# Altium schematic sheet ddr2_memory.SchDoc
size A
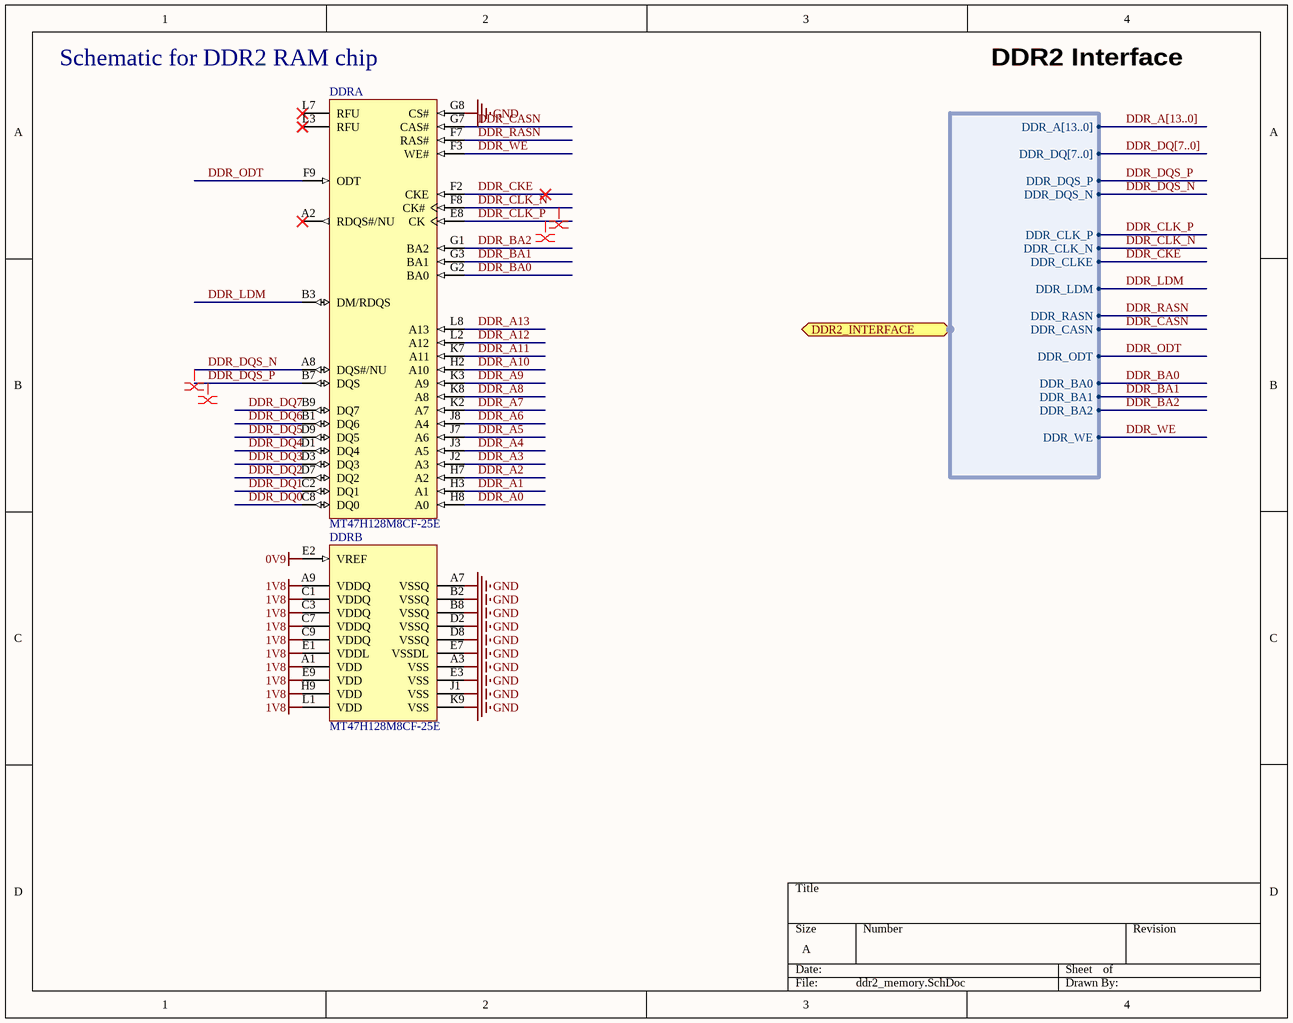
[diagram p0: ddr2_memory.SchDoc]

## Parts
DDR  MT47H128M8CF-25E  [MICT-CF-60]  (parts A,B of 2)

## Ports
DDR2_INTERFACE (harness DDR2_INTERFACE)

## Harnesses
DDR2_INTERFACE: DDR_A[13..0], DDR_DQ[7..0], DDR_DQS_P, DDR_DQS_N, DDR_CLK_P, DDR_CLK_N, DDR_LDM, DDR_RASN, DDR_CASN, DDR_ODT, DDR_BA0, DDR_BA1, DDR_BA2, DDR_WE, DDR_CLKE

## Nets
0V9: DDR.E2(VREF)
1V8: DDR.A1(VDD) DDR.A9(VDDQ) DDR.C1(VDDQ) DDR.C3(VDDQ) DDR.C7(VDDQ) DDR.C9(VDDQ) DDR.E1(VDDL) DDR.E9(VDD) DDR.H9(VDD) DDR.L1(VDD)
GND: DDR.A3(VSS) DDR.A7(VSSQ) DDR.B2(VSSQ) DDR.B8(VSSQ) DDR.D2(VSSQ) DDR.D8(VSSQ) DDR.E3(VSS) DDR.E7(VSSDL) DDR.G8(CS#) DDR.J1(VSS) DDR.K9(VSS)
DDR_A0: DDR.H8(A0)
DDR_A1: DDR.H3(A1)
DDR_A2: DDR.H7(A2)
DDR_A3: DDR.J2(A3)
DDR_A4: DDR.J3(A5)
DDR_A5: DDR.J7(A6)
DDR_A6: DDR.J8(A4)
DDR_A7: DDR.K2(A7)
DDR_A8: DDR.K8(A8)
DDR_A9: DDR.K3(A9)
DDR_A10: DDR.H2(A10)
DDR_A11: DDR.K7(A11)
DDR_A12: DDR.L2(A12)
DDR_A13: DDR.L8(A13)
DDR_BA0: DDR.G2(BA0) ; port DDR2_INTERFACE.DDR_BA0
DDR_BA1: DDR.G3(BA1) ; port DDR2_INTERFACE.DDR_BA1
DDR_BA2: DDR.G1(BA2) ; port DDR2_INTERFACE.DDR_BA2
DDR_CASN: DDR.G7(CAS#) ; port DDR2_INTERFACE.DDR_CASN
DDR_CKE: DDR.F2(CKE) ; port DDR2_INTERFACE.DDR_CLKE
DDR_CLK_N: DDR.F8(CK#) ; port DDR2_INTERFACE.DDR_CLK_N
DDR_CLK_P: DDR.E8(CK) ; port DDR2_INTERFACE.DDR_CLK_P
DDR_DQ0: DDR.C8(DQ0)
DDR_DQ1: DDR.C2(DQ1)
DDR_DQ2: DDR.D7(DQ2)
DDR_DQ3: DDR.D3(DQ3)
DDR_DQ4: DDR.D1(DQ4)
DDR_DQ5: DDR.D9(DQ5)
DDR_DQ6: DDR.B1(DQ6)
DDR_DQ7: DDR.B9(DQ7)
DDR_DQS_N: DDR.A8(DQS#/NU) ; port DDR2_INTERFACE.DDR_DQS_N
DDR_DQS_P: DDR.B7(DQS) ; port DDR2_INTERFACE.DDR_DQS_P
DDR_LDM: DDR.B3(DM/RDQS) ; port DDR2_INTERFACE.DDR_LDM
DDR_ODT: DDR.F9(ODT) ; port DDR2_INTERFACE.DDR_ODT
DDR_RASN: DDR.F7(RAS#) ; port DDR2_INTERFACE.DDR_RASN
DDR_WE: DDR.F3(WE#) ; port DDR2_INTERFACE.DDR_WE

Not connected (* = marked no-connect by the designer): DDR A2(RDQS#/NU)* L3(RFU)* L7(RFU)*

## Buses and harness runs
bus DDR_A[13..0]
bus DDR_DQ[7..0]

## Layout directives
differential pair: DDR_CLK_N, DDR_CLK_P, DDR_DQS_N, DDR_DQS_P

## Notes on the sheet
- (near DDR) Schematic for DDR2 RAM chip
- DDR2 Interface

## Library data of the parts
DDR = CMP-0354-00001-1: 1Gb DDR2-800 SDRAM, 128Mb x 8, 2.5ns, 1.8V, 0 to 85 degC, 60-Ball FBGA, Pb-Free; Manufacturer: Micron; Clock Rate: 400 MHz; CL: CL = 5; Op. Temp.: 0C to +85C; ComponentLink2URL: http://www.micron.com/~/media/Documents/Products/Data%20Sheet/DRAM/1Gb_DDR2.pdf; ComponentLink2Description: Datasheet; ComponentLink1URL: http://www.micron.com/; Voltage: 1.8V; PackageReference: MICT-CF-60; ComponentLink1Description: Manufacturer URL; Density: 1Gb; Package: FBGA; Data Rate: DDR2-800; Pin Count: 60-ball; Mounting Technology: Surface Mount; RoHS: Yes; Width: x8; DatasheetVersion: Rev.X; ComponentLink3URL: http://www.micron.com/~/media/Documents/Products/Data%20Sheet/DRAM/1Gb_1_55V_DDR2.pdf; PackageVersion: Rev.D; PartNumber: MT47H128M8CF-25E; ComponentLink3Description: Package Specification; PackageDescription: 60-Ball Fine-Pitch Ball Grid Array, 10 x 8 mm, Pitch 0.8 mm; Depth: 128Mb; Cycle Time: 2.5ns